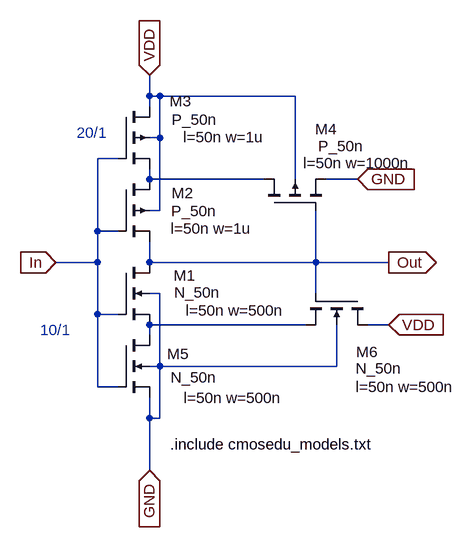
[diagram p0: schematic schmitty - Copy.asc]
schmitty - Copy.asc, the LTspice schematic file:
Version 4
SHEET 1 1136 680
WIRE 448 -432 448 -464
WIRE 464 -432 448 -432
WIRE 672 -432 464 -432
WIRE 448 -416 448 -432
WIRE 464 -368 464 -432
WIRE 464 -368 448 -368
WIRE 400 -336 368 -336
WIRE 448 -304 448 -320
WIRE 624 -304 448 -304
WIRE 672 -304 672 -432
WIRE 768 -304 720 -304
WIRE 464 -256 464 -368
WIRE 464 -256 448 -256
WIRE 368 -224 368 -336
WIRE 400 -224 368 -224
WIRE 368 -176 368 -224
WIRE 368 -176 304 -176
WIRE 448 -176 448 -208
WIRE 704 -176 704 -256
WIRE 704 -176 448 -176
WIRE 816 -176 704 -176
WIRE 464 -128 448 -128
WIRE 704 -128 704 -176
WIRE 368 -96 368 -176
WIRE 400 -96 368 -96
WIRE 688 -80 448 -80
WIRE 816 -80 784 -80
WIRE 448 -64 448 -80
WIRE 464 -16 464 -128
WIRE 464 -16 448 -16
WIRE 736 -16 736 -80
WIRE 736 -16 464 -16
WIRE 368 16 368 -96
WIRE 400 16 368 16
WIRE 448 64 448 32
WIRE 464 64 464 -16
WIRE 464 64 448 64
WIRE 448 144 448 64
FLAG 304 -176 In
IOPIN 304 -176 In
FLAG 448 144 GND
IOPIN 448 144 In
FLAG 816 -176 Out
IOPIN 816 -176 Out
FLAG 448 -464 VDD
IOPIN 448 -464 In
FLAG 816 -80 VDD
IOPIN 816 -80 In
FLAG 768 -304 GND
IOPIN 768 -304 In
SYMBOL nmos4 400 -176 R0
WINDOW 0 119 20 Right 2
WINDOW 3 157 46 Right 2
WINDOW 123 256 74 Right 2
SYMATTR InstName M1
SYMATTR Value N_50n
SYMATTR Value2 l=50n w=500n
SYMBOL pmos4 400 -304 R0
WINDOW 0 116 21 Right 2
WINDOW 3 151 49 Right 2
WINDOW 123 206 76 Right 2
SYMATTR InstName M2
SYMATTR Value P_50n
SYMATTR Value2 l=50n w=1u
SYMBOL pmos4 400 -416 R0
WINDOW 0 113 -8 Right 2
WINDOW 3 152 20 Right 2
WINDOW 123 225 47 Right 2
SYMATTR InstName M3
SYMATTR Value P_50n
SYMATTR Value2 l=50n w=1u
SYMBOL pmos4 624 -256 R270
WINDOW 0 125 113 VLeft 2
WINDOW 3 99 153 VLeft 2
WINDOW 123 73 226 VLeft 2
SYMATTR InstName M4
SYMATTR Value P_50n
SYMATTR Value2 l=50n w=1000n
SYMBOL nmos4 400 -64 R0
WINDOW 0 109 29 Right 2
WINDOW 3 152 65 Right 2
WINDOW 123 253 97 Right 2
SYMATTR InstName M5
SYMATTR Value N_50n
SYMATTR Value2 l=50n w=500n
SYMBOL nmos4 784 -128 R90
WINDOW 0 90 18 VLeft 2
WINDOW 3 115 19 VLeft 2
WINDOW 123 144 19 VLeft 2
SYMATTR InstName M6
SYMATTR Value N_50n
SYMATTR Value2 l=50n w=500n
TEXT 336 -376 Left 2 ;20/1
TEXT 280 -72 Left 2 ;10/1
TEXT 480 104 Left 2 !.include cmosedu_models.txt

The netlist it stands for:
* schmitty - Copy.asc
M1 Out In N002 GND N_50n l=50n w=500n
M2 N001 In Out VDD P_50n l=50n w=1u
M3 VDD In N001 VDD P_50n l=50n w=1u
M4 N001 Out GND VDD P_50n l=50n w=1000n
M5 N002 In GND GND N_50n l=50n w=500n
M6 VDD Out N002 GND N_50n l=50n w=500n
.model NMOS NMOS
.model PMOS PMOS
.lib standard.mos
* 20/1
* 10/1
.include cmosedu_models.txt
.backanno
.end